# Altium schematic sheet S7CAS-PLEIADES-CARTE-MERE_P01_FPGA-BANK4.SchDoc
size Tabloid; DocumentNumber: 15; SheetNumber: 15; SheetTotal: 17; Sheet_Name: FPGA - BANK 4; Size: 11x17
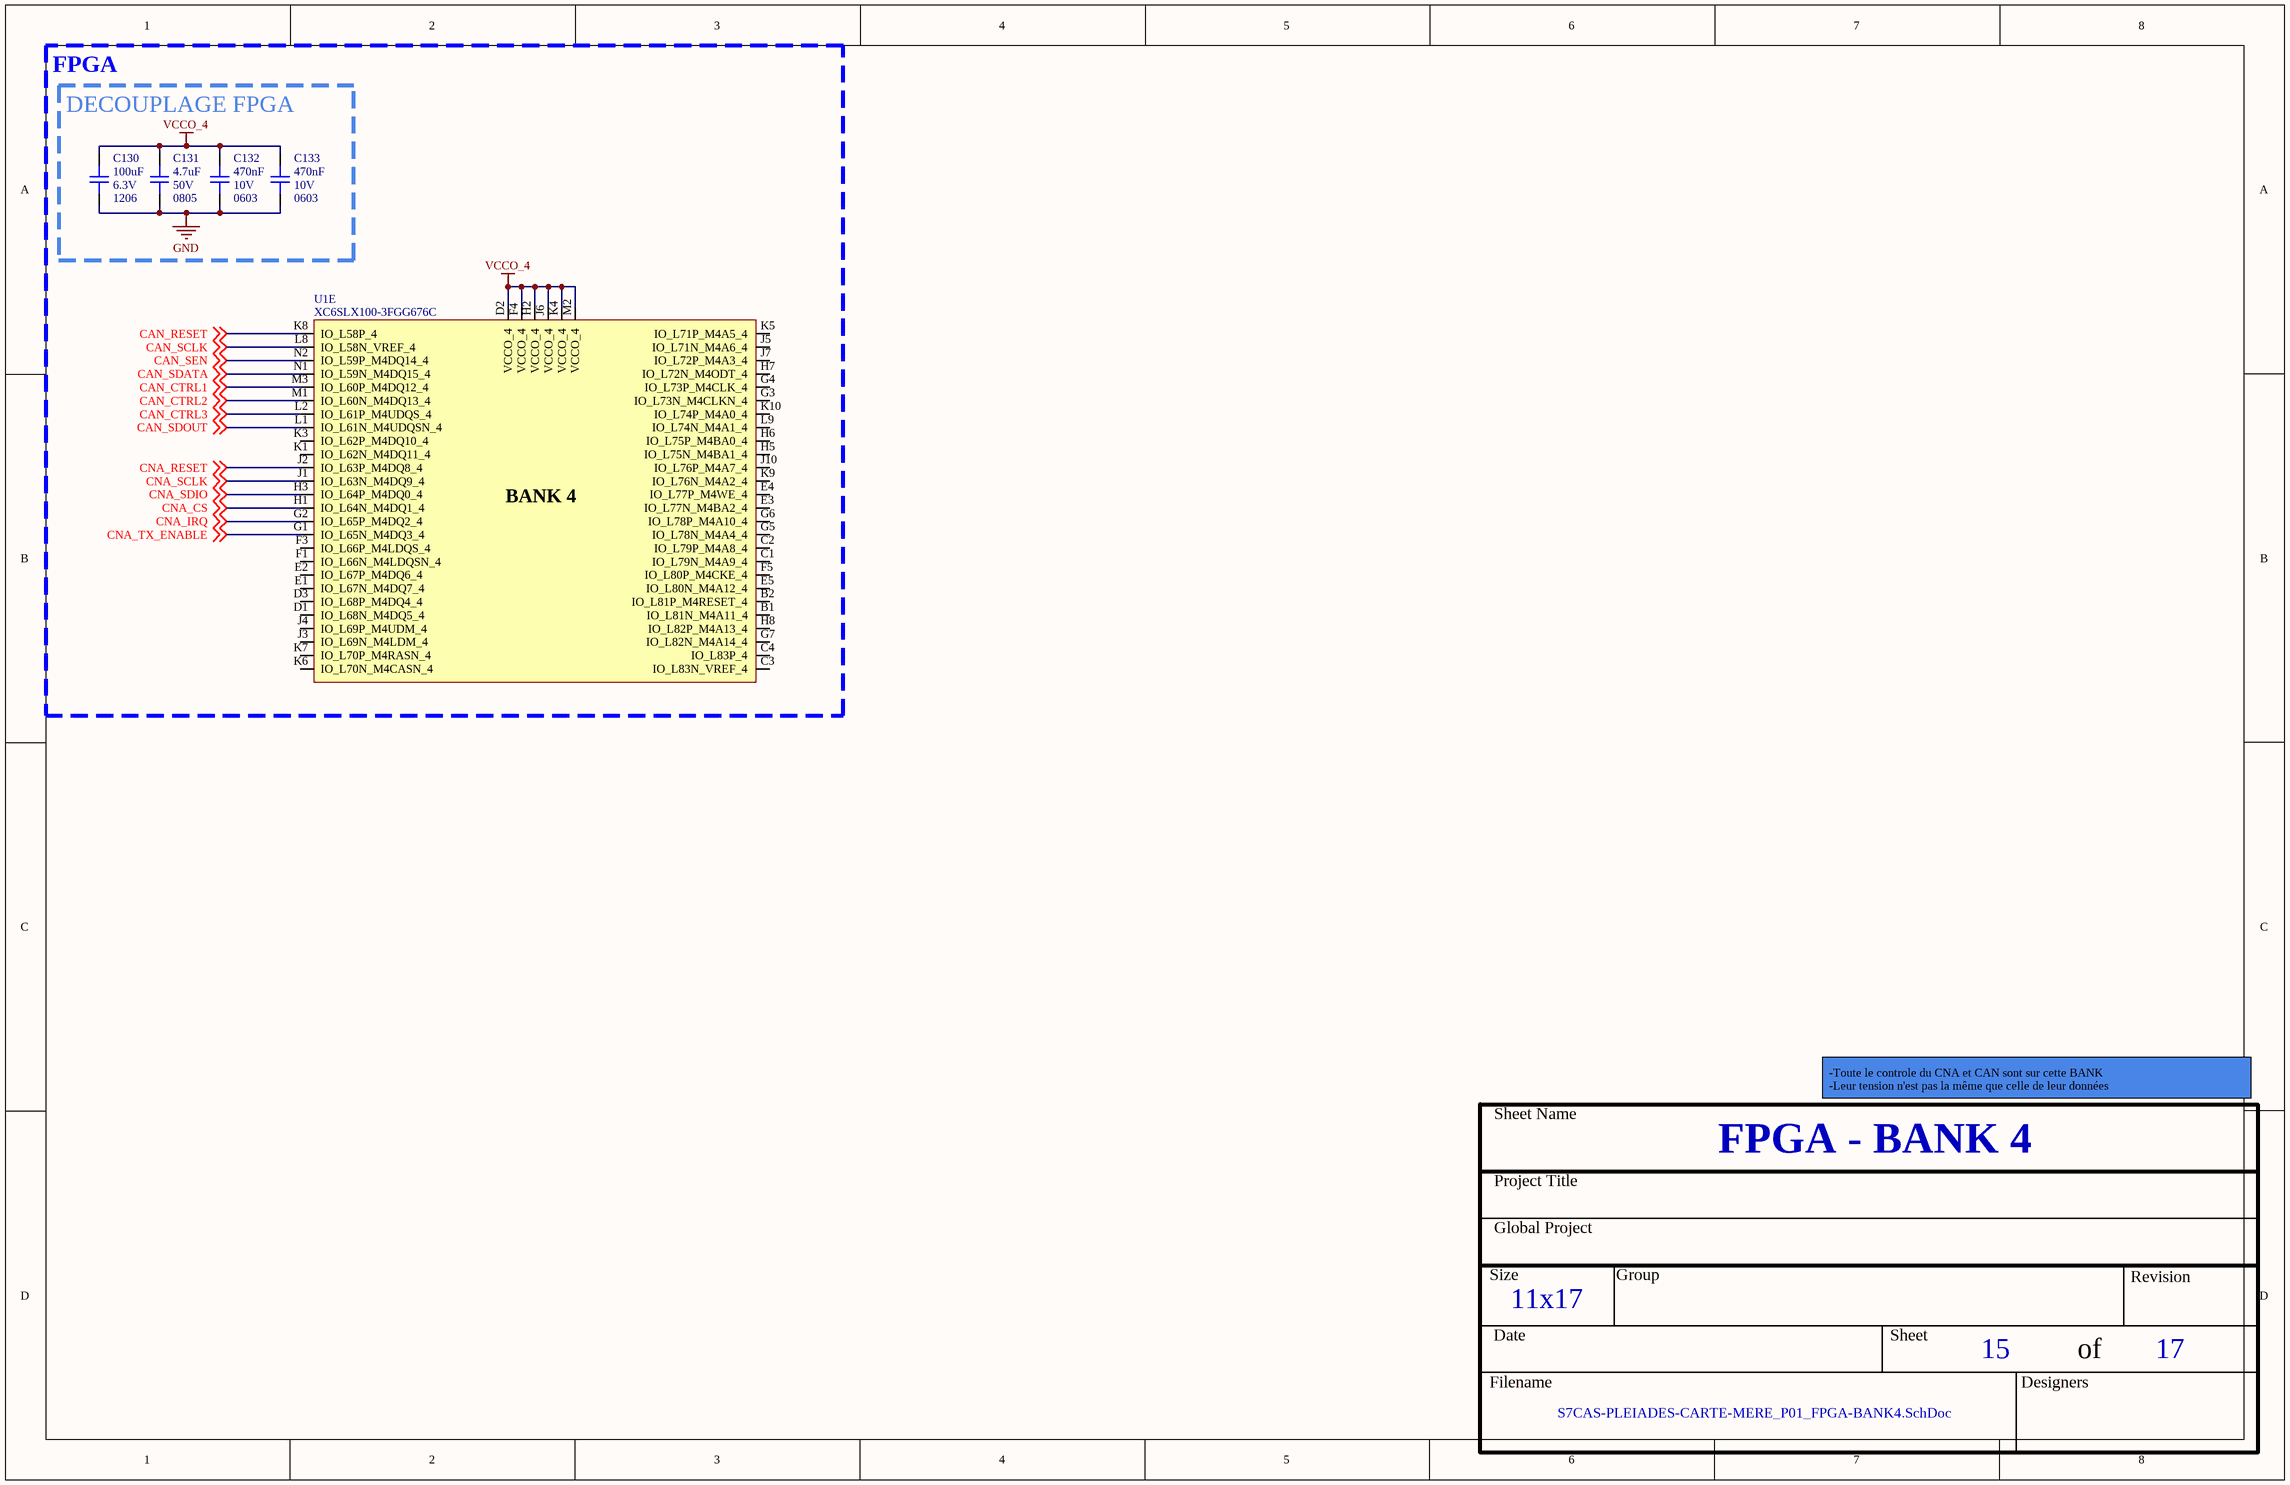
[diagram p0: S7CAS-PLEIADES-CARTE-MERE_P01_FPGA-BANK4.SchDoc]

## Parts
C130  value 100uF  Voltage: 6.3V  Package: 1206  [CAP_1206]  (hidden comment: CAP - 1206)
C131  value 4.7uF  Voltage: 50V  Package: 0805  [CAP_0805]  (hidden comment: CAP - 0805)
C132  value 470nF  Voltage: 10V  Package: 0603  [CAP_0603]  (hidden comment: CAP - 0603)
C133  value 470nF  Voltage: 10V  Package: 0603  [CAP_0603]  (hidden comment: CAP - 0603)
U1  XC6SLX100-3FGG676C  [FPGA_XILINX_FGG676]  (part E of 10)

## Blocks framed on the sheet
FPGA: U1
DECOUPLAGE FPGA: C130-C133

## Nets
GND: C130.1 C131.1 C132.1 C133.1
VCCO_4: C130.2 C131.2 C132.2 C133.2 U1.D2(VCCO_4) U1.F4(VCCO_4) U1.H2(VCCO_4) U1.J6(VCCO_4) U1.K4(VCCO_4) U1.M2(VCCO_4)
CAN_CTRL1: U1.M3(IO_L60P_M4DQ12_4) ; off-sheet CAN_CTRL1
CAN_CTRL2: U1.M1(IO_L60N_M4DQ13_4) ; off-sheet CAN_CTRL2
CAN_CTRL3: U1.L2(IO_L61P_M4UDQS_4) ; off-sheet CAN_CTRL3
CAN_RESET: U1.K8(IO_L58P_4) ; off-sheet CAN_RESET
CAN_SCLK: U1.L8(IO_L58N_VREF_4) ; off-sheet CAN_SCLK
CAN_SDATA: U1.N1(IO_L59N_M4DQ15_4) ; off-sheet CAN_SDATA
CAN_SDOUT: U1.L1(IO_L61N_M4UDQSN_4) ; off-sheet CAN_SDOUT
CAN_SEN: U1.N2(IO_L59P_M4DQ14_4) ; off-sheet CAN_SEN
CNA_CS: U1.H1(IO_L64N_M4DQ1_4) ; off-sheet CNA_CS
CNA_IRQ: U1.G2(IO_L65P_M4DQ2_4) ; off-sheet CNA_IRQ
CNA_RESET: U1.J2(IO_L63P_M4DQ8_4) ; off-sheet CNA_RESET
CNA_SCLK: U1.J1(IO_L63N_M4DQ9_4) ; off-sheet CNA_SCLK
CNA_SDIO: U1.H3(IO_L64P_M4DQ0_4) ; off-sheet CNA_SDIO
CNA_TX_ENABLE: U1.G1(IO_L65N_M4DQ3_4) ; off-sheet CNA_TX_ENABLE

Not connected (* = marked no-connect by the designer): U1 B1(IO_L81N_M4A11_4) B2(IO_L81P_M4RESET_4) C1(IO_L79N_M4A9_4) C2(IO_L79P_M4A8_4) C3(IO_L83N_VREF_4) C4(IO_L83P_4) D1(IO_L68N_M4DQ5_4) D3(IO_L68P_M4DQ4_4) E1(IO_L67N_M4DQ7_4) E2(IO_L67P_M4DQ6_4) E3(IO_L77N_M4BA2_4) E4(IO_L77P_M4WE_4) E5(IO_L80N_M4A12_4) F1(IO_L66N_M4LDQSN_4) F3(IO_L66P_M4LDQS_4) F5(IO_L80P_M4CKE_4) G3(IO_L73N_M4CLKN_4) G4(IO_L73P_M4CLK_4) G5(IO_L78N_M4A4_4) G6(IO_L78P_M4A10_4) G7(IO_L82N_M4A14_4) H5(IO_L75N_M4BA1_4) H6(IO_L75P_M4BA0_4) H7(IO_L72N_M4ODT_4) H8(IO_L82P_M4A13_4) J3(IO_L69N_M4LDM_4) J4(IO_L69P_M4UDM_4) J5(IO_L71N_M4A6_4) J7(IO_L72P_M4A3_4) J10(IO_L76P_M4A7_4) K1(IO_L62N_M4DQ11_4) K3(IO_L62P_M4DQ10_4) K5(IO_L71P_M4A5_4) K6(IO_L70N_M4CASN_4) K7(IO_L70P_M4RASN_4) K9(IO_L76N_M4A2_4) K10(IO_L74P_M4A0_4) L9(IO_L74N_M4A1_4)

## Notes on the sheet
- -Toute le controle du CNA et CAN sont sur cette BANK
  -Leur tension n'est pas la même que celle de leur données
- Sheet Name
- Project Title
- Global Project
- Size
- Group
- Revision
- Date
- Sheet
- of
- Filename
- Designers
- (in symbol FPGA_XC6SLX100-3FGG676C, part E) BANK 4

## Library data of the parts
C130 = CAP - 1206: 100 µF ±20% 6.3V Ceramic Capacitor X6T 1206 (3216 Metric); Mfg Part Number: GRM31CD80J107MEA8K; Mfg: Murata Electronics; Current: *; CreatedBy: Jonathan Bouchard; Power: *; Precision: 20%
C131 = CAP - 0805: 4.7 µF ±10% 50V Ceramic Capacitor X5R 0805 (2012 Metric); Mfg Part Number: GRT21BR61H475KE13L; Mfg: Murata Electronics; Current: *; CreatedBy: Jonathan Bouchard; Power: *; Precision: 10%
C132 C133 = CAP - 0603: Mfg Part Number: C0603X474K8RAC; Precision: 10%; Current: *; CreatedBy: Jonathan Bouchard; Power: *
U1 = FPGA_XC6SLX100-3FGG676C: FPGA - XILINX SPARTAN 6 480 I/O - BGA-676; Voltage: 1.14 V ~ 1.26 V; Current: *; Power: *; Mfg: Xilinx; Mfg Part Number: XC6SLX100-3FGG676C; HelpURL: https://www.xilinx.com/support/documentation/data_sheets/ds162.pdf; CreatedBy: Jonathan Bouchard; Temperature: 0°C ~ 85°C (TJ); Value: *; Precision: *; Package: BGA-676; Supplier 1: Digikey; Supplier Part Number 1: 122-1760-ND; Part Number #1: XC6SLX100-3FGG676C